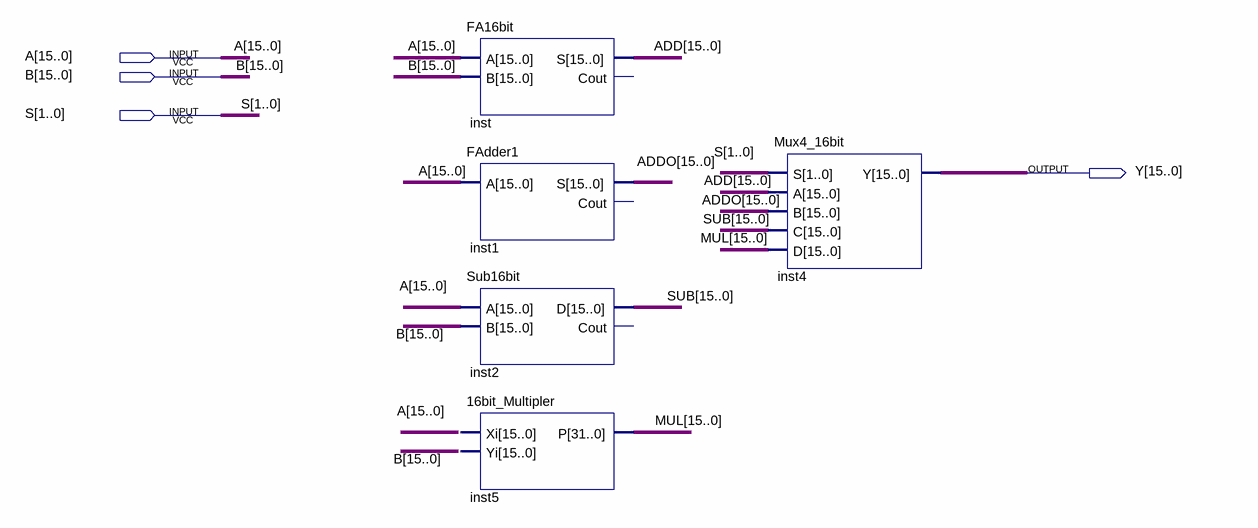
[diagram p0: schematic sheet]
// Quartus schematic AU_16bit.bdf as structural Verilog: 5 symbols, 4 pins
module AU_16bit (
  input  [15:0] A,
  input  [15:0] B,
  input  [1:0] S,
  output [15:0] Y
);

  wire [15:0] ADD, ADDO, MUL, SUB;

  FA16bit inst (.A(A), .B(B), .S(ADD));  // open: Cout
  FAdder1 inst1 (.A(A), .S(ADDO));  // open: Cout
  Sub16bit inst2 (.A(A), .B(B), .D(SUB));  // open: Cout
  \16bit_Multipler  inst5 (.P(MUL));  // open: Xi, Yi
  Mux4_16bit inst4 (.S(S), .A(ADD), .B(ADDO), .C(SUB), .D(MUL), .Y(Y));
endmodule
